# Altium project Remotor.PrjPcb
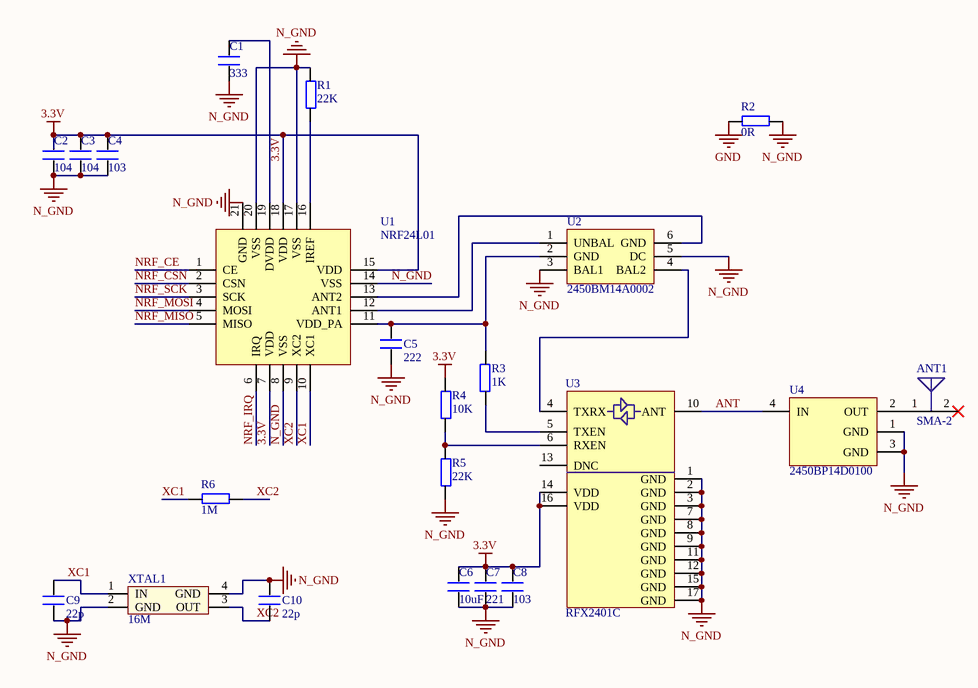
[diagram p0: Remotor.SchDoc]
2 sheets, 84 parts. Net scope: global (net labels, ports and power ports of the same name join across sheets).
Board file: Remotor_v1.0.PcbDoc
Sheets:
  Remotor.SchDoc
  Remotor_1.SchDoc

## Sheet Remotor.SchDoc
size A4

### Parts
ANT1  SMA-2  [SMB]
C1  333  [0402]
C2  104  [0402]
C3  104  [0402]
C4  103  [0402]
C5  222  [0402]
C6  10uF  [0805]
C7  221  [0402]
C8  103  [0402]
C9  22p  [0402]
C10  22p  [0402]
R1  22K  [0402]
R2  0R  [0402]
R3  1K  [0402]
R4  10K  [0402]
R5  22K  [0402]
R6  1M  [0402]
U1  NRF24L01  [QFN20]
U2  2450BM14A0002  [0603-6]
U3  RFX2401C  [QFN16M]
U4  2450BP14D0100  [BALUN_250BP]
XTAL1  16M  [XTAL3225   无源]

### Nets
3.3V: C2.2 C3.2 C4.2 C6.1 C7.1 C8.1 R4.2 U1.7(VDD) U1.15(VDD) U1.18(VDD) U3.14(VDD) U3.16(VDD)
GND: R2.2
N_GND: C1.1 C2.1 C3.1 C4.1 C5.2 C6.2 C7.2 C8.2 C9.2 C10.1 R1.2 R2.1 R5.1 U1.8(VSS) U1.14(VSS) U1.17(VSS) U1.20(VSS) U1.21(GND) U2.3(BAL1) U2.5(DC) U3.1(GND) U3.2(GND) U3.3(GND) U3.7(GND) U3.8(GND) U3.9(GND) U3.11(GND) U3.12(GND) U3.15(GND) U3.17(GND) U4.1(GND) U4.3(GND) XTAL1.2(GND) XTAL1.4(GND)
ANT: U3.10(ANT) U4.4(IN)
NRF_CE: U1.1(CE)
NRF_CSN: U1.2(CSN)
NRF_IRQ: U1.6(IRQ)
NRF_MISO: U1.5(MISO)
NRF_MOSI: U1.4(MOSI)
NRF_SCK: U1.3(SCK)
XC1: C9.1 R6.2 U1.10(XC1) XTAL1.1(IN)
XC2: C10.2 R6.1 U1.9(XC2) XTAL1.3(OUT)
NetANT1_1: ANT1.1(FP) U4.2(OUT)
NetC1_2: C1.2 U1.19(DVDD)
NetC5_1: C5.1 R3.1 U1.11(VDD_PA) U2.2(GND)
NetR1_1: R1.1 U1.16(IREF)
NetR3_2: R3.2 U3.5(TXEN)
NetR4_1: R4.1 R5.2 U3.6(RXEN)
NetU1_12: U1.12(ANT1) U2.1(UNBAL)
NetU1_13: U1.13(ANT2) U2.6(GND)
NetU2_4: U2.4(BAL2) U3.4(TXRX)

Not connected (* = marked no-connect by the designer): ANT1 2(NC)*; U3 13(DNC)

### Library data of the parts
ANT1 = CHIP_ANTENNA
C1-C10 = C
R1-R6 = R
U1 = nrf24xx
U2 = BALUN
U4 = BALUN_1
XTAL1 = XTAL-无源贴片: 无源贴片晶振

## Sheet Remotor_1.SchDoc
size 304 x 203 mm
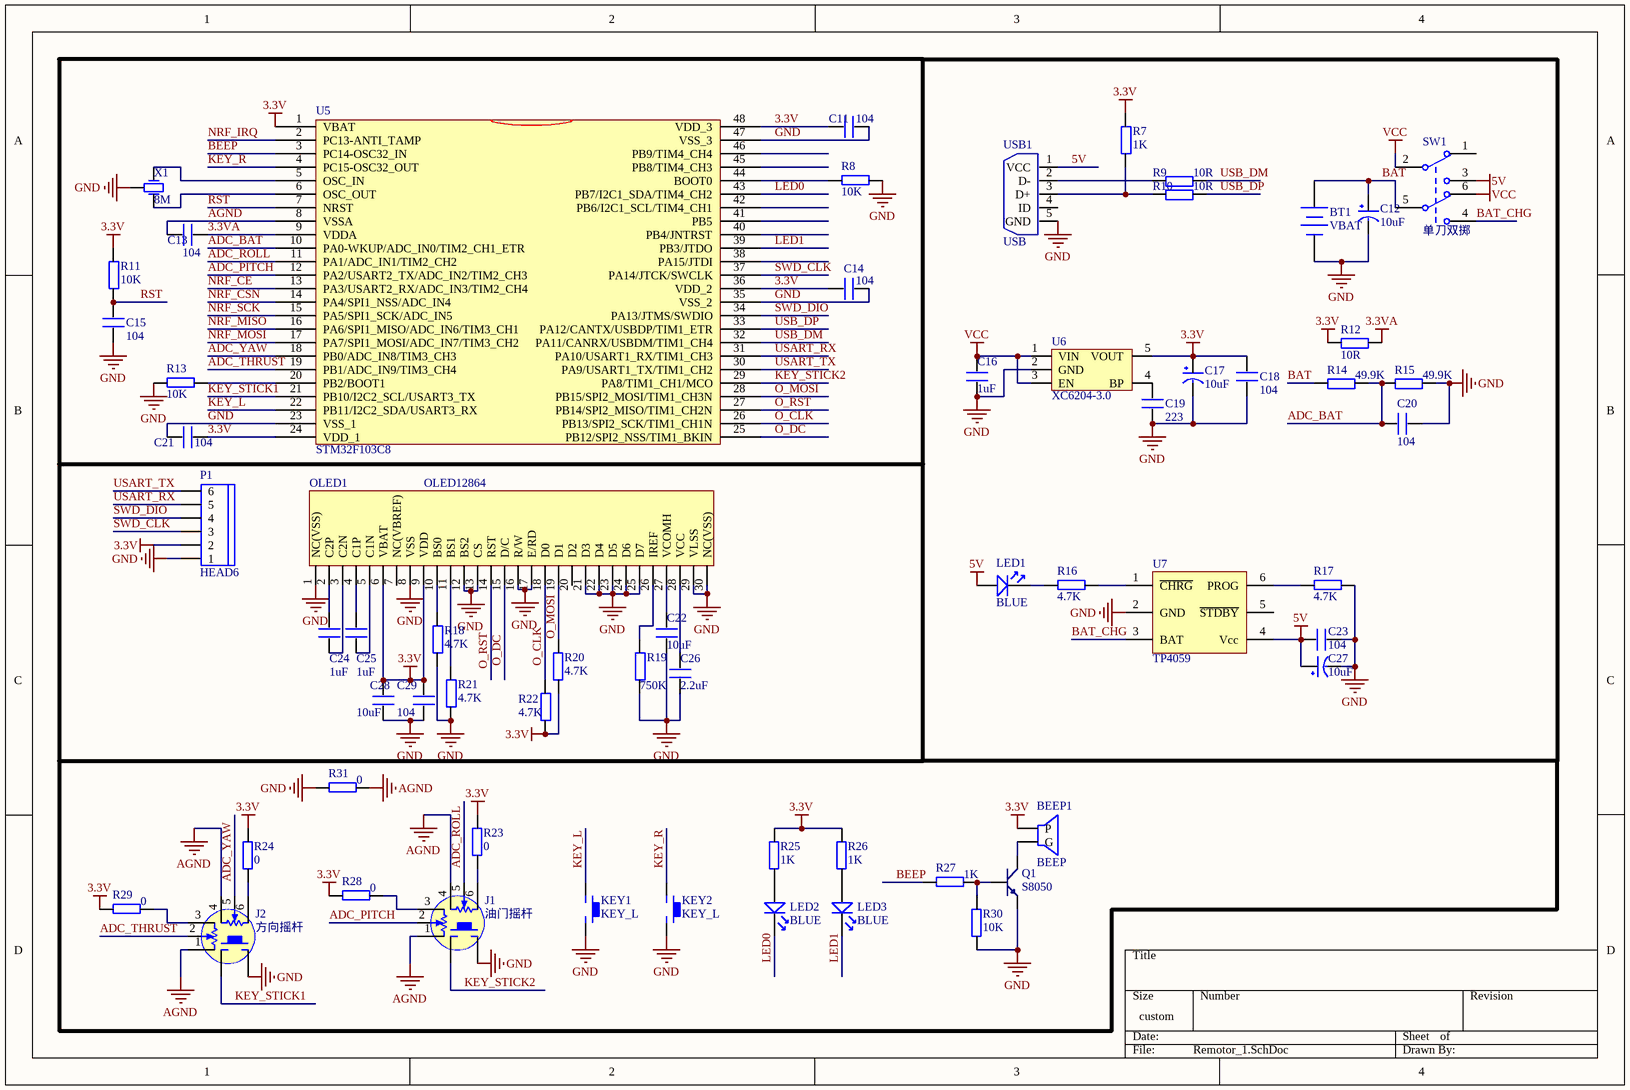
[diagram p1: Remotor_1.SchDoc]

### Parts
BEEP1  BEEP  [BELL-5]
BT1  VBAT  [BAT-2]
C11  104  [0402]
C12  10uF  [C0805 钽电容]
C13  104  [0402]
C14  104  [0402]
C15  104  [0402]
C16  1uF  [0402]
C17  10uF  [C0805 钽电容]
C18  104  [0402]
C19  223  [0402]
C20  104  [0402]
C21  104  [0402]
C22  10uF  [0805]
C23  104  [0402]
C24  1uF  [0402]
C25  1uF  [0402]
C26  2.2uF  [0402]
C27  10uF  [C0805 钽电容]
C28  10uF  [0805]
C29  104  [0402]
J1  油门摇杆  [摇杆2]
J2  方向摇杆  [摇杆2]
KEY1  KEY_L  [KEY_M]
KEY2  KEY_L  [KEY_M]
LED1  BLUE  [0603]
LED2  BLUE  [0603]
LED3  BLUE  [0603]
OLED1  OLED12864  [OLED_0.96]
P1  HEAD6  [SH1.0-6P]
Q1  S8050  [SOT-23R]
R7  1K  [0402]
R8  10K  [0402]
R9  10R  [0402]
R10  10R  [0402]
R11  10K  [0402]
R12  10R  [0402]
R13  10K  [0402]
R14  49.9K  [0402]
R15  49.9K  [0402]
R16  4.7K  [0402]
R17  4.7K  [0402]
R18  4.7K  [0402]
R19  750K  [0402]
R20  4.7K  [0402]
R21  4.7K  [0402]
R22  4.7K  [0402]
R23  0  [0402]
R24  0  [0402]
R25  1K  [0402]
R26  1K  [0402]
R27  1K  [0402]
R28  0  [0402]
R29  0  [0402]
R30  10K  [0402]
R31  0  [0402]
SW1  单刀双掷  [拨动开关DIP]
U5  STM32F103C8  [mTQFP48]
U6  XC6204-3.0  [SOT-23-5]
U7  TP4059  [SOT-23-6]
USB1  USB  [MICRO_USB5P_SOP]
X1  8M  [XTAL3215]

### Nets
3.3V: BEEP1.1(P) C11.2 C14.2 C17.1(VCC) C18.2 C21.1 C28.2 C29.2 OLED1.6(VBAT) OLED1.9(VDD) P1.2 R7.2 R11.2 R12.1 R20.2 R22.1 R23.1 R24.1 R25.1 R26.1 R28.2 R29.2 U5.1(VBAT) U5.24(VDD_1) U5.36(VDD_2) U5.48(VDD_3) U6.5(VOUT)
3.3VA: C13.2 R12.2 U5.9(VDDA)
5V: C23.2 C27.1(VCC) LED1.1 SW1.3 U7.4(Vcc) USB1.1(VCC)
AGND: C13.1 J1.1 J1.4 J2.1 J2.4 R31.1 U5.8(VSSA)
GND: BT1.2(-) C11.1 C12.2(GND) C14.1 C15.1 C16.1 C17.2(GND) C18.1 C19.1 C20.2 C21.2 C22.1 C23.1 C26.1 C27.2(GND) C28.1 C29.1 J1.J1 J2.J1 KEY1.2 KEY2.2 OLED1.1(NC(VSS)) OLED1.8(VSS) OLED1.12(BS2) OLED1.13(CS) OLED1.16(R/W) OLED1.17(E/RD) OLED1.21(D3) OLED1.22(D4) OLED1.23(D5) OLED1.24(D6) OLED1.25(D7) OLED1.29(VLSS) OLED1.30(NC(VSS)) P1.1 Q1.1(E) R8.1 R13.2 R15.2 R17.1 R18.1 R19.1 R21.1 R30.2 R31.2 U5.23(VSS_1) U5.35(VSS_2) U5.47(VSS_3) U6.2(GND) U7.2(GND) USB1.5(GND) X1.2(GND)
VCC: C16.2 SW1.2 SW1.6 U6.1(VIN) U6.3(EN)
ADC_BAT: C20.1 R14.2 R15.1 U5.10(PA0-WKUP/ADC_IN0/TIM2_CH1_ETR)
ADC_PITCH: J1.2 U5.12(PA2/USART2_TX/ADC_IN2/TIM2_CH3)
ADC_ROLL: J1.5 U5.11(PA1/ADC_IN1/TIM2_CH2)
ADC_THRUST: J2.2 U5.19(PB1/ADC_IN9/TIM3_CH4)
ADC_YAW: J2.5 U5.18(PB0/ADC_IN8/TIM3_CH3)
BAT: BT1.1(+) C12.1(VCC) R14.1 SW1.5
BAT_CHG: SW1.4 U7.3(BAT)
BEEP: R27.2 U5.3(PC14-OSC32_IN)
KEY_L: KEY1.1 U5.22(PB11/I2C2_SDA/USART3_RX)
KEY_R: KEY2.1 U5.4(PC15-OSC32_OUT)
KEY_STICK1: J2.J2 U5.21(PB10/I2C2_SCL/USART3_TX)
KEY_STICK2: J1.J2 U5.29(PA8/TIM1_CH1/MCO)
LED0: LED2.2 U5.43(PB7/I2C1_SDA/TIM4_CH2)
LED1: LED3.2 U5.39(PB3/JTDO)
NRF_CE: U5.13(PA3/USART2_RX/ADC_IN3/TIM2_CH4)
NRF_CSN: U5.14(PA4/SPI1_NSS/ADC_IN4)
NRF_IRQ: U5.2(PC13-ANTI_TAMP)
NRF_MISO: U5.16(PA6/SPI1_MISO/ADC_IN6/TIM3_CH1)
NRF_MOSI: U5.17(PA7/SPI1_MOSI/ADC_IN7/TIM3_CH2)
NRF_SCK: U5.15(PA5/SPI1_SCK/ADC_IN5)
O_CLK: OLED1.18(D0) R22.2 U5.26(PB13/SPI2_SCK/TIM1_CH1N)
O_DC: OLED1.15(D/C) U5.25(PB12/SPI2_NSS/TIM1_BKIN)
O_MOSI: OLED1.19(D1) R20.1 U5.28(PB15/SPI2_MOSI/TIM1_CH3N)
O_RST: OLED1.14(RST) U5.27(PB14/SPI2_MISO/TIM1_CH2N)
RST: C15.2 R11.1 U5.7(NRST)
SWD_CLK: P1.3 U5.37(PA14/JTCK/SWCLK)
SWD_DIO: P1.4 U5.34(PA13/JTMS/SWDIO)
USART_RX: P1.5 U5.31(PA10/USART1_RX/TIM1_CH3)
USART_TX: P1.6 U5.30(PA9/USART1_TX/TIM1_CH2)
USB_DM: R9.2 U5.32(PA11/CANRX/USBDM/TIM1_CH4)
USB_DP: R10.2 U5.33(PA12/CANTX/USBDP/TIM1_ETR)
NetBEEP1_2: BEEP1.2(G) Q1.3(C)
NetC19_2: C19.2 U6.4(BP)
NetC22_2: C22.2 OLED1.27(VCOMH)
NetC24_1: C24.1 OLED1.3(C2N)
NetC24_2: C24.2 OLED1.2(C2P)
NetC25_1: C25.1 OLED1.5(C1N)
NetC25_2: C25.2 OLED1.4(C1P)
NetC26_2: C26.2 OLED1.28(VCC)
NetJ1_3: J1.3 R28.1
NetJ1_6: J1.6 R23.2
NetJ2_3: J2.3 R29.1
NetJ2_6: J2.6 R24.2
NetLED1_2: LED1.2 R16.2
NetLED2_1: LED2.1 R25.2
NetLED3_1: LED3.1 R26.2
NetOLED1_10: OLED1.10(BS0) R18.2
NetOLED1_11: OLED1.11(BS1) R21.2
NetOLED1_26: OLED1.26(IREF) R19.2
NetQ1_2: Q1.2(B) R27.1 R30.1
NetR7_1: R7.1 R10.1 USB1.3(D+)
NetR8_2: R8.2 U5.44(BOOT0)
NetR9_1: R9.1 USB1.2(D-)
NetR13_1: R13.1 U5.20(PB2/BOOT1)
NetR16_1: R16.1 U7.1(~{CHRG})
NetR17_2: R17.2 U7.6(PROG)
NetU5_5: U5.5(OSC_IN) X1.1(OSC1)
NetU5_6: U5.6(OSC_OUT) X1.3(OSC2)

Not connected (* = marked no-connect by the designer): OLED1 7(NC(VBREF)) 20(D2); SW1 1; U5 38(PA15/JTDI) 40(PB4/JNTRST) 41(PB5) 42(PB6/I2C1_SCL/TIM4_CH1) 45(PB8/TIM4_CH3) 46(PB9/TIM4_CH4); U7 5(~{STDBY}); USB1 4(ID)

### Library data of the parts
BT1 = Battery: Multicell Battery; Published: 24-Mar-1999; LatestRevisionDate: 17-Jul-2002; LatestRevisionNote: Re-released for DXP Platform.; PackageReference: BAT-2; Publisher: Altium Limited
C11 C13-C16 C18-C26 C28 C29 = C
C12 C17 C27 = CAP
J1 = 摇杆
J2 = 摇杆_1: 摇杆
KEY1 KEY2 = KEY
LED1-LED3 = LED
Q1 = NPN: 8050/BCW846/BCW847
R7-R31 = R
SW1 = 单刀双掷开关
U5 = STM32F103C6
U6 = RT9193-33: 3.3V超低压差LDO
U7 = TP2459: 600mA充电芯片
USB1 = USB5
X1 = XTAL-3215

## Nets that join several sheets
3.3V: Remotor (12 pins), Remotor_1 (27 pins)
GND: Remotor (R2.2), Remotor_1 (52 pins)
NRF_CE: Remotor (U1.1), Remotor_1 (U5.13)
NRF_CSN: Remotor (U1.2), Remotor_1 (U5.14)
NRF_IRQ: Remotor (U1.6), Remotor_1 (U5.2)
NRF_MISO: Remotor (U1.5), Remotor_1 (U5.16)
NRF_MOSI: Remotor (U1.4), Remotor_1 (U5.17)
NRF_SCK: Remotor (U1.3), Remotor_1 (U5.15)